# Altium schematic sheet MOSFTET_Driver_block.SchDoc
size A4; SheetNumber: 2; SheetTotal: 4
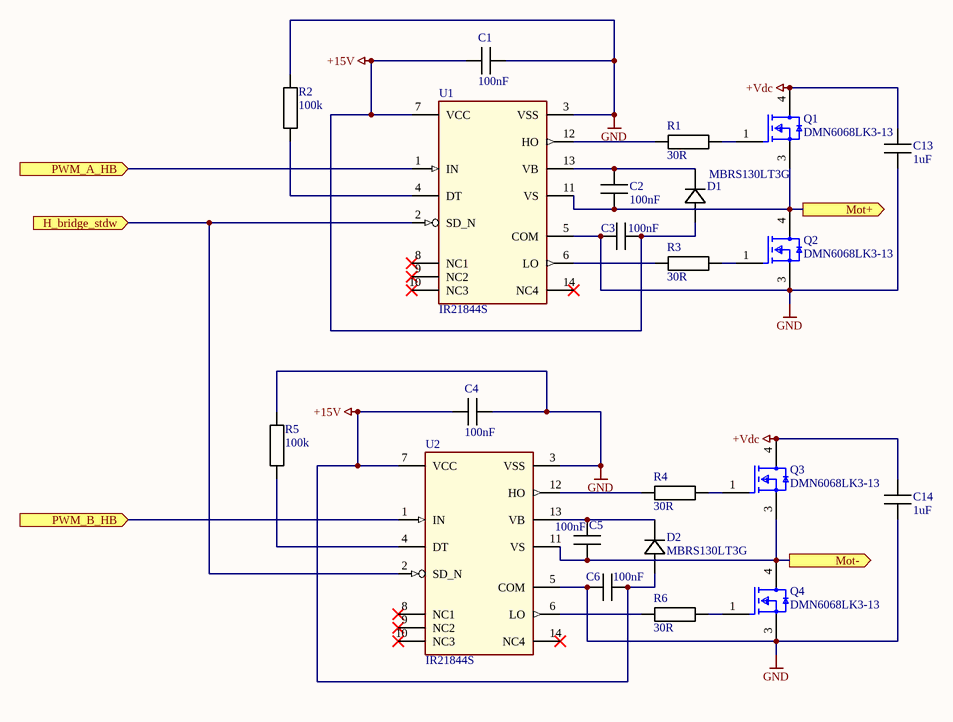
[diagram p0: MOSFTET_Driver_block.SchDoc]

## Parts
C1  100nF  [CAPC1608X08M]
C2  100nF  [CAPC1608X08M]
C3  100nF  [CAPC1608X08M]
C4  100nF  [CAPC1608X08M]
C5  100nF  [CAPC1608X08M]
C6  100nF  [CAPC1608X08M]
C13  1uF  [CAPC2012X08M]
C14  1uF  [CAPC2012X08M]
D1  MBRS130LT3G  [DIODE_SMB_2L_ONS]
D2  MBRS130LT3G  [DIODE_SMB_2L_ONS]
Q1  DMN6068LK3-13  [FP-TO252_DPAK-MFG]
Q2  DMN6068LK3-13  [FP-TO252_DPAK-MFG]
Q3  DMN6068LK3-13  [FP-TO252_DPAK-MFG]
Q4  DMN6068LK3-13  [FP-TO252_DPAK-MFG]
R1  30R  [RESC2012X06M]
R2  100k  [RESC2012X06M]
R3  30R  [RESC2012X06M]
R4  30R  [RESC2012X06M]
R5  100k  [RESC2012X06M]
R6  30R  [RESC2012X06M]
U1  IR21844S  [SOIC127P600X175-14N-12-V]
U2  IR21844S  [SOIC127P600X175-14N-12-V]

## Ports
H_bridge_stdw (in), Mot+ (out), Mot- (out), PWM_A_HB (in), PWM_B_HB (in)

## Nets
+15V: C1.2 C3.1 C4.2 C6.1 D1.2 D2.2 U1.7(VCC) U2.7(VCC)
+Vdc: C13.2 C14.2 Q1.4(D) Q3.4(D)
GND: C1.1 C3.2 C4.1 C6.2 C13.1 C14.1 Q2.3(S) Q4.3(S) R2.2 R5.2 U1.3(VSS) U1.5(COM) U2.3(VSS) U2.5(COM)
H_bridge_stdw: U1.2(SD_N) U2.2(SD_N) ; port H_bridge_stdw
Mot+: C2.2 Q1.3(S) Q2.4(D) U1.11(VS) ; port Mot+
Mot-: C5.1 Q3.3(S) Q4.4(D) U2.11(VS) ; port Mot-
PWM_A_HB: U1.1(IN) ; port PWM_A_HB
PWM_B_HB: U2.1(IN) ; port PWM_B_HB
NetC2_1: C2.1 D1.1 U1.13(VB)
NetC5_2: C5.2 D2.1 U2.13(VB)
NetQ1_1: Q1.1(G) R1.2
NetQ2_1: Q2.1(G) R3.2
NetQ3_1: Q3.1(G) R4.2
NetQ4_1: Q4.1(G) R6.2
NetR1_1: R1.1 U1.12(HO)
NetR2_1: R2.1 U1.4(DT)
NetR3_1: R3.1 U1.6(LO)
NetR4_1: R4.1 U2.12(HO)
NetR5_1: R5.1 U2.4(DT)
NetR6_1: R6.1 U2.6(LO)

Not connected (* = marked no-connect by the designer): U1 8(NC1)* 9(NC2)* 10(NC3)* 14(NC4)*; U2 8(NC1)* 9(NC2)* 10(NC3)* 14(NC4)*

## Library data of the parts
C1-C6 = CMP-065-000000-2: CAPC 100nF X7R 50V 10% 1608 (0603 INCH); Manufacturer: TDK; Manufacturer Number: CGA3E2X7R1H104K080AA; IsStocked: 1; PN: PN-338083; Current: NULL; TemperatureRange: -55°C to +125°C; Voltage: 50V; Dielectric: X7R; Value: 100nF; Category: Passives; Supplier Price 1: 0.0100; Supplier Part Number 1: FAB.0603_C 100n; SubCategory: Condensateurs ceramique; Tolerance: ±10%; Supplier 1: ETML; TemperatureCoeff: NULL; Power: NULL
C13 C14 = CMP-065-000041-2: CAPC 1uF X5R 25V 10% 2012 (0805 INCH); Manufacturer: TDK; Manufacturer Number: C2012X5R1E105K125AA; Value: 1µF; TemperatureRange: -55°C to +85°C; IsStocked: 1; PN: PN-324029; Supplier 1: ETML; Category: Passives; Supplier Part Number 1: FAB.0805_C 1u; SubCategory: Condensateurs ceramique; Tolerance: ±10%; Supplier Price 1: 0.0223; Dielectric: X5R; Voltage: 25V
D1 D2 = MBRS130LT3G: Description; Manufacturer_Name: onsemi; Copyright: Copyright (C) 2025 Ultra Librarian. All rights reserved.; Manufacturer_Part_Number: MBRS130LT3G
Q1-Q4 = CMP-12801-000004-1: MOSFET N-CH 60V 6A DPAK; Manufacturer: Diodes Inc.; Transconductance: 19.7S; Input Capacitace At Vds: 502pF @ 30V; Gate To Source Voltage: 20V; Turn On Delay Time: 3.6ns; Typ Forward Diode Voltage: 0.98V; Max Forward Diode Voltage: 1.15V; Gate Charge At Vgs: 10.3nC @ 10V; Number Of Channels: 1; Threshold Vgs Max: 3V; Threshold Vgs Min: 1V; Power Dissipation: 2.12W; Max Junction Temp: +150°C; Rthja Max: 59°C/W; Reverse Recovery Charge: 929nC; Turn Off Delay Time: 11.9ns; Drain To Source Resistance: 0.068Ω; Standoff Height: 0mm; Depletion Mode: False; Reverse Recovery Time: 145ns; Pulse Drain Current: 22.2A; Automotive Grade: Grade 0; Category: Trans; Footprint Url: https://www.diodes.com/assets/Package-Files/TO252-DPAK.pdf; Temperature Range Low: -55°C; Device Class L3: MOSFETs; Automotive: Yes; Package: TO252 (DPAK); Drain To Source Breakdown Voltage: 60V; Device Class L1: Discrete Semiconductors; Mouser Description: Supplied as a Tape, N-Channel MOSFET, 8.5 A, 60 V, 3-Pin DPAK Diodes Inc DMN6068LK3-13; Continuous Drain Current: 6A; ComponentLink2Description: Datasheet; ComponentLink2URL: https://www.diodes.com/assets/Datasheets/DMN6068LK3.pdf; Device Class L2: Transistors; Height: 2.52mm; Number Of N Channels: 1; Temperature Range High: +150°C; Drain To Source Voltage: 60V; Temperature: -55°C to +150°C; Octopart: https://octopart.com/dmn6068lk3-13-diodes+inc.-17947797; Manufacturer Part Number: DMN6068LK3-13; RoHS: TRUE; Digikey Description: MOSFET N-CH 60V 6A DPAK; Lead Free: Yes
R1 R3 R4 R6 = CMP-066-000175-2: RES 100ohm  ±1% 0.125W 2012 (0805 INCH); Manufacturer: Yageo; Manufacturer Number: RC0805FR-07100RL; TemperatureCoeff: ±200ppm/°C; Value: 100; Voltage: 150V; PN: PN-217910; TemperatureRange: -55°C to 155°C; IsStocked: 1; SubCategory: Resistances couche epaisse; Supplier Price 1: 0.0200; Tolerance: ±1%; Supplier Part Number 1: FAB.0805_R 100R; Supplier 1: ETML; Category: Passives; Power: 0.125W
R2 R5 = CMP-066-000211-2: RES 100kohm  ±1% 0.125W 2012 (0805 INCH); Manufacturer: Yageo; Manufacturer Number: RC0805FR-07100KL; TemperatureCoeff: ±200ppm/°C; Voltage: 150V; TemperatureRange: -55°C to 155°C; IsStocked: 1; PN: PN-903408; Category: Passives; Supplier Part Number 1: FAB.0805_R 100k; Value: 100k; Tolerance: ±1%; Supplier Price 1: 0.0200; Power: 0.125W; SubCategory: Resistances couche epaisse; Supplier 1: ETML
U1 U2 = IR21844S: Half-bridge gate driver with integrated bootstrap diode; Alternate View: No; Symbol Type: Half-bridge gate driver with integrated bootstrap diode; Multiple Parts: No